# Altium schematic sheet Power_Regulation.SchDoc
size A
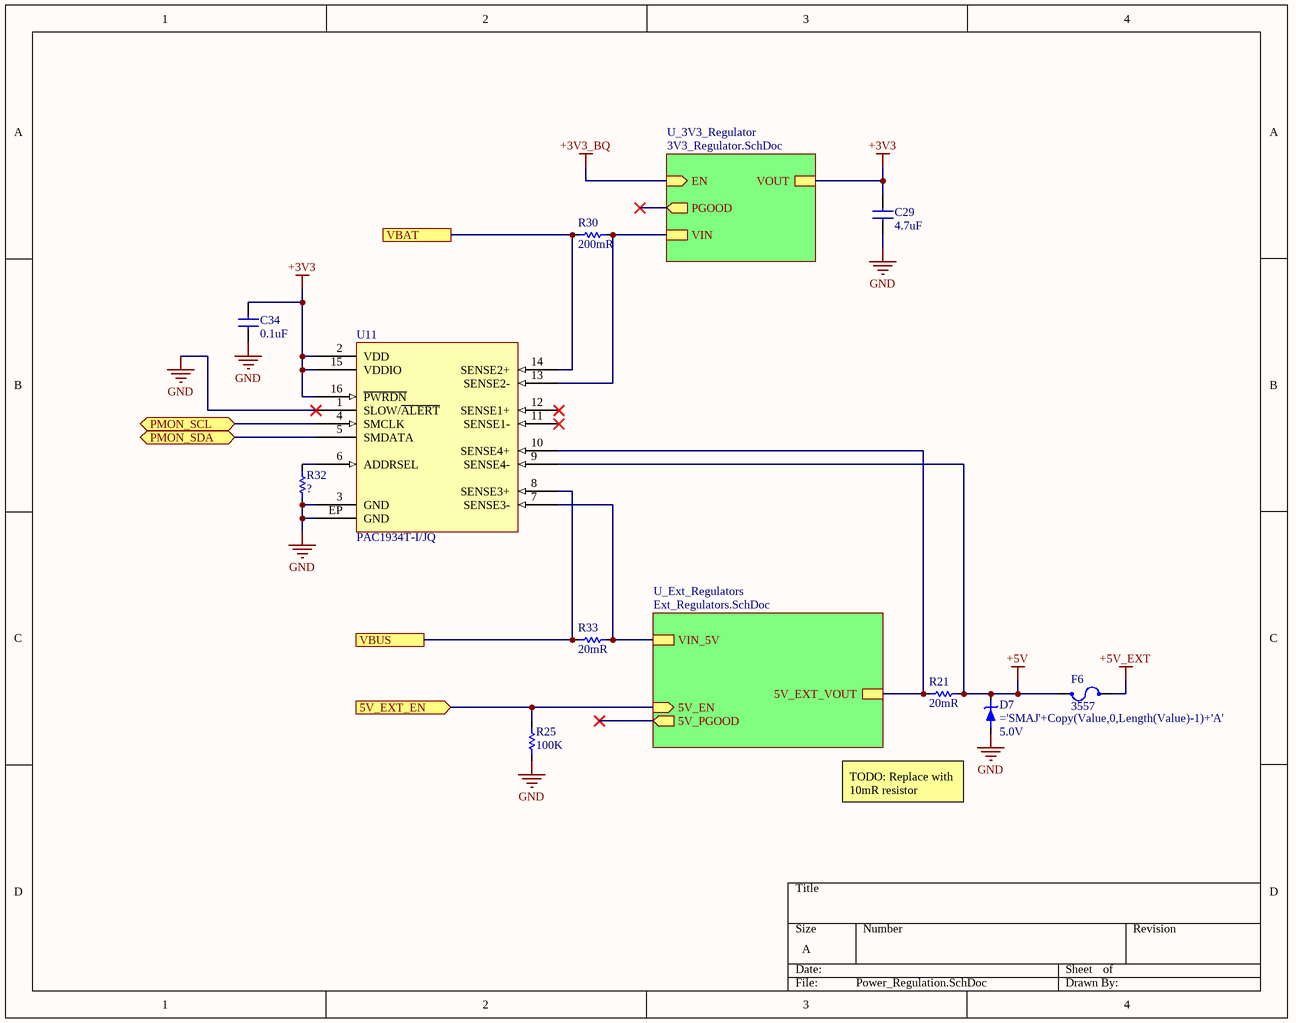
[diagram p0: Power_Regulation.SchDoc]

## Parts
C29  value 4.7uF  [0805_Capacitor]  (hidden comment: CAP 4.7uF 16V X5R)
C34  value 0.1uF  [0402_CAPACITOR]  (hidden comment: CAP 0.1uF 16V X7R)
D7  value 5.0V  [SMA]  (hidden comment: TVS Diode)
F6  3557  [F_3557_Mini]
R21  value 20mR  [0805_Resistor]  (hidden comment: CRF0805-FZ-R020ELF)
R25  value 100K  [0402_Resistor]  (hidden comment: R_0402_100K_1%)
R30  value 200mR  [0603_Resistor]  (hidden comment: CSR0603FKR200)
R32  R_0402_?_1%  [0402_Resistor]  (value not drawn)
R33  value 20mR  [0805_Resistor]  (hidden comment: CRF0805-FZ-R020ELF)
U11  PAC1934T-I/JQ  [QFN-16-EP_4x4mm]

## Sub-sheets
U_3V3_Regulator = 3V3_Regulator.SchDoc: VIN, EN (in), VOUT, PGOOD (out)
U_Ext_Regulators = Ext_Regulators.SchDoc: VIN_5V, 5V_EXT_VOUT, 5V_PGOOD (out), 5V_EN (in)

## Ports
5V_EXT_EN (in), PMON_SCL (bidir), PMON_SDA (bidir), VBAT, VBUS

## Nets
+3V3: C29.1 C34.1 U11.2(VDD) U11.15(VDDIO) U11.16(~{PWRDN}) ; sheet U_3V3_Regulator/VOUT
+3V3_BQ: sheet U_3V3_Regulator/EN
+5V: D7.2(Cathode) F6.1 R21.2 U11.9(SENSE4-)
+5V_EXT: F6.2
GND: C29.2 C34.2 D7.1(Anode) R25.1 R32.1 U11.1(SLOW/~{ALERT}) U11.3(GND) U11.EP(GND)
5V_EXT_EN: R25.2 ; port 5V_EXT_EN, sheet U_Ext_Regulators/5V_EN
PMON_SCL: U11.4(SMCLK) ; port PMON_SCL
PMON_SDA: U11.5(SMDATA) ; port PMON_SDA
VBAT: R30.1 U11.14(SENSE2+) ; port VBAT
VBUS: R33.1 U11.8(SENSE3+) ; port VBUS
NetR21_1: R21.1 U11.10(SENSE4+) ; sheet U_Ext_Regulators/5V_EXT_VOUT
NetR30_2: R30.2 U11.13(SENSE2-) ; sheet U_3V3_Regulator/VIN
NetR32_2: R32.2 U11.6(ADDRSEL)
NetR33_2: R33.2 U11.7(SENSE3-) ; sheet U_Ext_Regulators/VIN_5V

Not connected (* = marked no-connect by the designer): U11 11(SENSE1-)* 12(SENSE1+)*

## Notes on the sheet
- TODO: Replace with 10mR resistor

## Library data of the parts
C29 = C_0805_4.7uF_16V_10%: CAP CERM 4.7uF 10% 16V 0805; SVP Creator: Spencer Berglund; Package: =SelectedPackage; Voltage: 16V; Temperature Coefficient: X5R; Supplier 1: Digi-Key; Supplier Part Number 1: 1276-1065-6-ND
C34 = C_0402_0.1uF_16V_10%: CAP CERM 0.1uF 10% 16V 0402; Package: =SelectedPackage; Voltage: 16V; Temperature Coefficient: X7R; Supplier 1: Digi-Key; Supplier Part Number 1: 1276-1001-1-ND; Supplier 2: Digi-Key; Supplier Part Number 2: 587-1451-1-ND
D7 = D_TVS_SMAJ_Uni_generic: SMA Unidirectional TVS Diode; Manufacturer: Vishay; Power - Peak Pulse: 400W; Type: Zener; Operating Temperature: -55°C ~ 150°C; HelpURL: http://www.vishay.com/docs/88392/smbj.pdf; Manufacturer PN: ='SMAJ'+Copy(Value,0,Length(Value)-1)+'A'
F6 = F_3557_MINI_ATO: Manufacturer: Keystone Electronics; Material: Brass,Nickel; Body Material: Brass; Current Rating: 30A; Voltage Rating (AC): 500V; Number of Circuits: 1; Fuse Current: 20A; Supplier 1: Digi-Key; Manufacturer Part Number: 3557; Stock 1: 70386; Pricing 1: 1=0.2, 10=0.185, 50=0.145, 100=0.1282, 250=0.1134, 500=0.1085, 1000=0.0887, 2500=0.0813, 5000=0.0789 (USD); Mount: Through Hole,Vertical,PCB; Contact Plating: Nickel,Tin; Contact Material: Brass; Min Operating Temperature: -50°C; Max Operating Temperature: 145°C; Package Quantity: 1; Termination: PC Pin; Orientation: Vertical; Packaging: Bulk; Voltage: 500V; Length: 0.4inch; Height: 0.15inch; Depth: 4.7mm; Width: 0.185inch; REACH SVHC: No SVHC; Lead Free: Lead Free; ComponentLink1URL: https://datasheet.ciiva.com/16425/m60-2p39-16425699.pdf; ComponentLink1Description: https://datasheet.ciiva.com/16425/m60-2p39-16425699.pdf; ComponentLink2URL: https://datasheet.ciiva.com/22650/1686040-22650696.pdf; ComponentLink2Description: https://datasheet.ciiva.com/22650/1686040-22650696.pdf; Supplier Part Number 1: 3557K-ND
R21 R33 = R_CRF0805-FZ-R020ELF: 20 mOhms ±1% 0.5W, 1/2W Chip Resistor 0805 (2012 Metric) Automotive AEC-Q200, Current Sense, Moisture Resistant Metal Element; Manufacturer: Bourns; Temperature Coefficient: 50ppm/°C; Min Operating Temperature: -55°C; Max Power Dissipation: 0.5W; Manufacturer Part Number: CRF0805-FZ-R020ELF; Max Operating Temperature: 170°C; Composition: Metal Element; Tolerance: 1%; Supplier 1: Digi-Key; Supplier Part Number 1: CRF0805-FZ-R020ELFDKR-ND
R25 R32 = R_0402_generic_1%: Generic 0402 Resistor (10.2R to 10M); Manufacturer: Yageo; Power Rating: 0.0625W; Temperature Coefficient: ±100ppm/°C; Tolerance: ±1%; Voltage Rating: 50V; Operating Temperature: -55°C ~ 155°C; Manufacturer Part Number: ='RC0402FR-07'+ValueFormatted+'L'; HelpURL: https://www.digikey.com/products/en/resistors/chip-resistor-surface-mount/52?pv17=103&FV=fffc000d%2Cc0001%2C1c0002%2C1f140000%2Cffe00034&k=RC0402; ValueFormatted: =Copy(Copy(Value, 0, Pos('.', Value)-1)+Copy(Value, Length(Value), 1)+Copy(Value, Pos('.', Value)+1, Length(Value)-Pos('.', Value)-1),1,Pos('.',Value)*Length(Value))+Copy(Value,1,Length(Value)*(1-Pos('.',Value)))
  R32: Value: ?
R30 = R_CSR0603FKR200: 200 mOhms ±1% 0.125W, 1/8W Chip Resistor 0603 (1608 Metric) Current Sense Thick Film; Manufacturer: Stackpole Electronics; Temperature Coefficient: 300ppm/°C; Min Operating Temperature: -55°C; Max Power Dissipation: 0.125W; Manufacturer Part Number: CSR0603FKR200; Max Operating Temperature: 155°C; Composition: Thick Film; Tolerance: 1%; Supplier 1: Digi-Key; Supplier Part Number 1: CSR0603FKR200CT-ND
U11 = U_PAC1934T-I/JQ: Current Monitor Regulator High-Side 16-UQFN (4x4); Supplier 1: Digi-Key; Supplier Part Number 1: PAC1934T-I/JQCT-ND